# Altium schematic sheet 100046138_power.SchDoc
size 863 x 558 mm; SheetNumber: 4; SheetTotal: 4
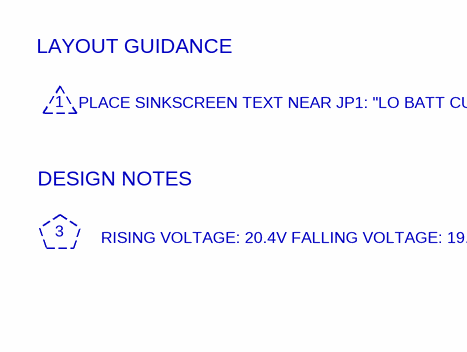
[diagram p0: 100046138_power.SchDoc, left]
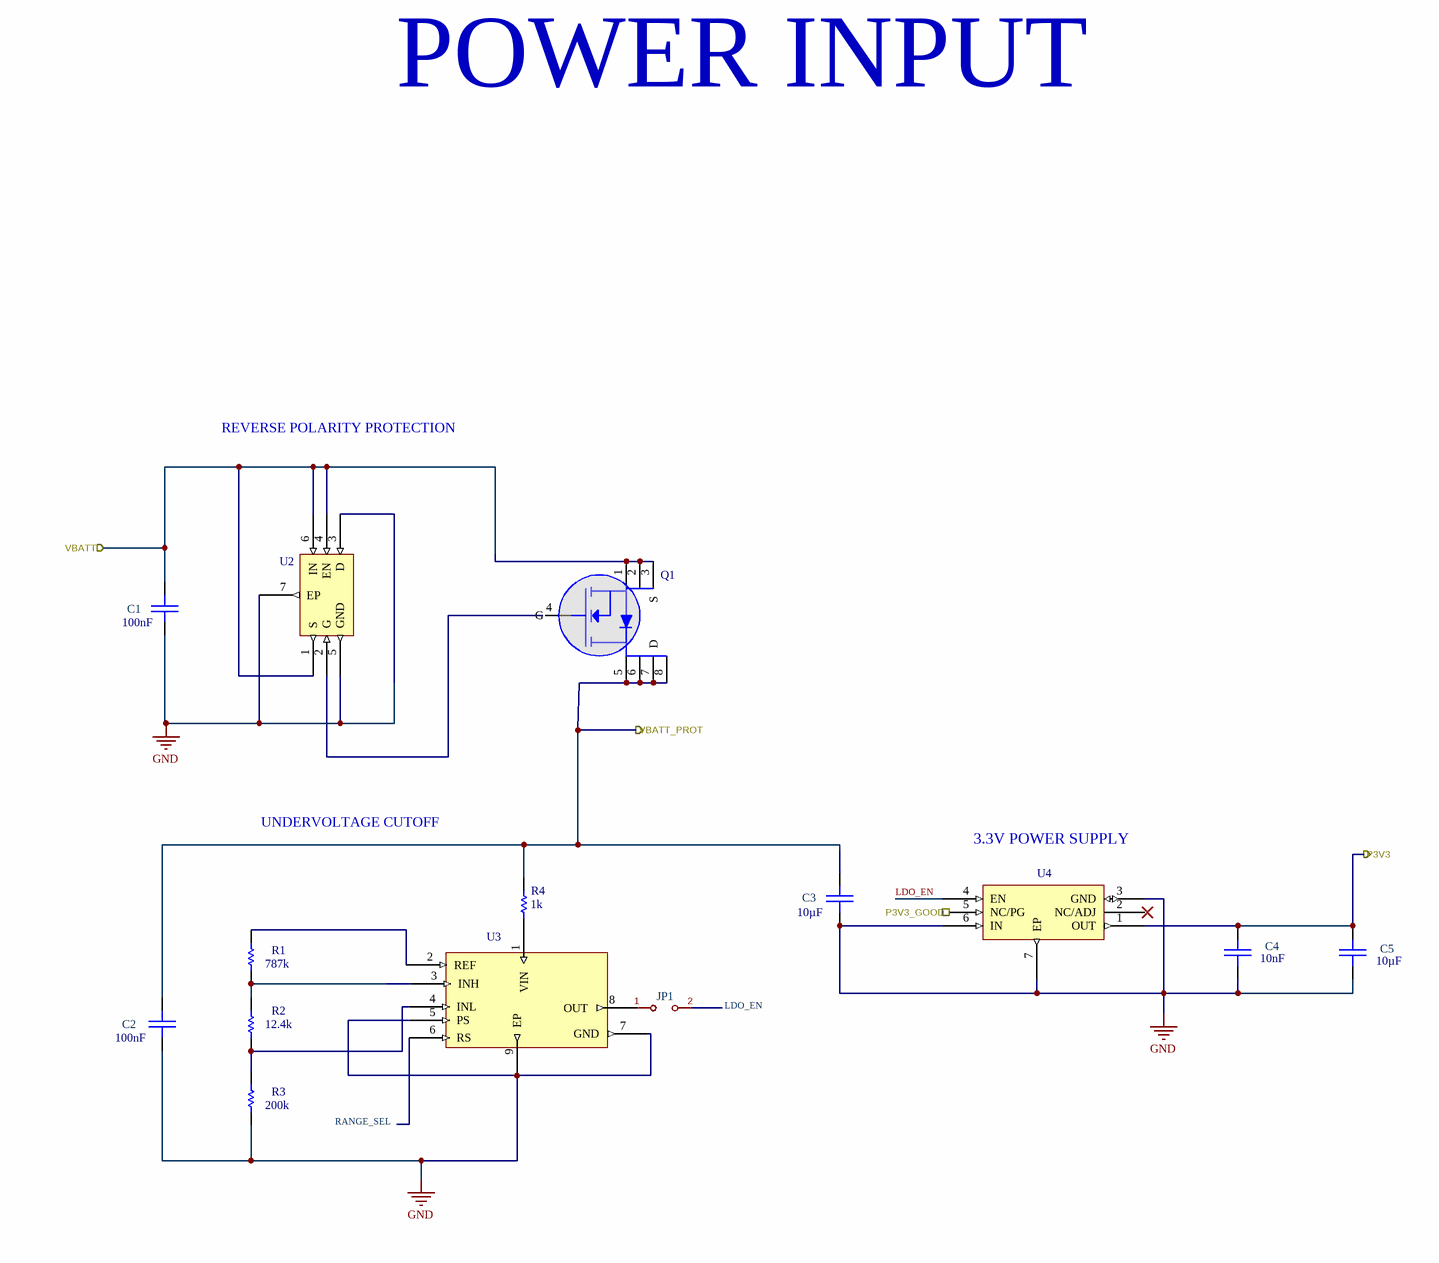
[diagram p1: 100046138_power.SchDoc, right]

## Parts
?  NCP730BMT330TBG  [IC-WDFN6-B]  (value not drawn)
C1  value 100nF  [CAP-0402-A]  (hidden comment: Cap 0402 100nF 10% X7R)
C2  value 100nF  [CAP-0402-A]  (hidden comment: Cap 0402 100nF 10% X7R)
C3  value 10µF  [CAP-0805-A]  (hidden comment: CAP 0805 10UF 50V 10% X5R)
C4  value 10nF  [CAP-0402-A]  (hidden comment: Cap 0402 10000pf 50V 10% X7R)
C5  value 10µF  [CAP-0402-A]  (hidden comment: Cap 0402 10uF 10V 20% X5R)
JP1  Jumper_2_Bridged  [SolderJumper-2_P1.3mm_Open_TrianglePad1.0x1.5mm]  (value not drawn)
Q1  MOSFET - SINGLE - N CHANNEL - 8PIN  [IC-8PQFN-A]  (value not drawn)
R1  value 787k  [RES-0402-A]  (hidden comment: RES 0402 787K 1% 1/10W)
R2  value 12.4k  [RES-0402-A]  (hidden comment: RES 0402 12.4K 1% 1/16W)
R3  value 200k  [RES-0402-C]  (hidden comment: Res 0402 200K 1/16W 1% Thick Film)
R4  value 1k  [RES-0402-A]  (hidden comment: RES 0402 1K 1/10W 1%)
U2  NCV68261MTWAITBG  [IC-WDFN6-C]  (value not drawn)
U3  LTC2965HDD  [IC-DFN8-3x3-A]  (value not drawn)

## Ports
P3V3 (out), P3V3_GOOD (out), VBATT (in), VBATT_PROT (out)

## Nets
GND: ?.3(GND) ?.6(IN) ?.7(EP) C1.1 C2.1 C3.1 C4.1 C5.1 R3.1 U2.3(D) U2.5(GND) U2.7(EP) U3.5(PS) U3.7(GND) U3.9(EP)
LDO_EN: ?.4(EN)
P3V3: ?.1(OUT) C4.2 C5.2 ; port P3V3
P3V3_GOOD: ?.5(NC/PG) ; port P3V3_GOOD
VBATT: C1.2 Q1.1(S) Q1.2(S) Q1.3(S) U2.1(S) U2.4(EN) U2.6(IN) ; port VBATT
VBATT_PROT: C2.2 C3.2 Q1.5(D) Q1.6(D) Q1.7(D) Q1.8(D) R4.2 ; port VBATT_PROT
NetJP1_1: JP1.1(A) U3.8(OUT)
NetR1_1: R1.1 R2.2 U3.3(INH)
NetR1_2: R1.2 U3.2(REF)
NetR2_1: R2.1 R3.2 U3.4(INL)

Not connected (* = marked no-connect by the designer): ? 2(NC/ADJ); JP1 2(B); Q1 4(G); R4 1; U2 2(G); U3 1(VIN) 6(RS)

## Notes on the sheet
- LAYOUT GUIDANCE
- 1
- PLACE SINKSCREEN TEXT NEAR JP1:
  "LO BATT CUTOFF"
- DESIGN NOTES
- 3
- RISING VOLTAGE: 20.4V
  FALLING VOLTAGE: 19.2V
- POWER INPUT
- REVERSE POLARITY PROTECTION
- UNDERVOLTAGE CUTOFF
- 3.3V POWER SUPPLY
- U4
- Labels drawn without touching a wire or pin: LDO_EN, RANGE_SEL
- DWG NO
- REVISIONS
- SH
- REVISION
- DESCRIPTION
- DATE(YEAR-MO-DA)
- APPROVED
- PART NO.
- DESIGN ACTIVITY
- US ARMY
  COMBAT CAPABILITIES DEVELOPMENT COMMAND ARMAMENTS CENTER
  PICATINNY ARSENAL, NEW JERSEY 07806-5000
- SIZE
- CAGE CODE
- DWG NO.
- D
- 19200
- SCALE
- NONE
- UNIT WT.
- ---
- SHEET

## Library data of the parts
? = IC-00416-3: LDO Regulator, 150 mA, 38 V, 1 uA IQ, with PG 3V3 HZ, WDFN6 2x2; Manufacturer Lifecycle Status: ACTIVE; Accuracy: 1%; Dropout Voltage: 290mV; Max Junction Temperature (Tj): 125°C; Max Supply Voltage: 38V; Min Input Voltage: 4.3V; Number of Channels: 1; Output Current: 150mA; Output Voltage: 3.3V; Voltage Tolerance: 2%; China RoHS: Compliant; Export Control Classification Number (ECCN) Code: EAR99; Harmonized Tariff Schedule (HTS) Code: 8542.39.00.60; Height - Seated (Max): 800µm; Height: 800µm; Introduction Date: 2019-11-13; Length: 2mm; Lifecycle Status: Production; Max Operating Temperature: 150°C; Min Supply Voltage: 4.3V; Number of Circuits: 1; Number of Outputs: 1; Number of Terminals: 6; REACH SVHC: Yes; RoHS: Compliant; Terminal Pitch: 650µm; Width: 2mm
C1 C2 = CAP-00363-2: Leader Qty: 100; UOM: EA; Voltage Rating: 50V; Footprint: Capacitor_SMD:C_0402_1005Metric; Case/Package: 0402; Max Operating Temperature: 125°C; Min Operating Temperature: -55°C; Mounting Technology: Surface Mount; Tolerance: 10%
C3 = CAP-00370-1: Leader Qty: 100; UOM: EA; Footprint: Capacitor_SMD:C_0805_2012Metric; Case/Package: 0805; Dielectric: X5R; Max Operating Temperature: 85°C; Min Operating Temperature: -55°C; Mounting Technology: Surface Mount
C4 = CAP-00186-4: 0402 10 nF 50 V ±10 % Tolerance X7R SMT Multilayer Ceramic Capacitor; Leader Qty: 100; Footprint: Capacitor_SMD:C_0402_1005Metric; Case/Package: 0402; Case Code (Imperial): 0402; Max Operating Temperature: 125°C; Min Operating Temperature: -55°C; Mounting Technology: Surface Mount; RoHS Compliant: Yes; Tolerance: 10%; Voltage Rating: 50V
C5 = CAP-00021-6: Capacitor Type: Ceramic; Leader Qty: 100; Footprint: Capacitor_SMD:C_0402_1005Metric; Case/Package: 0402; Max Operating Temperature: 85°C; Min Operating Temperature: -55°C; Mounting Technology: SMT; Pins: 2; RoHS Compliant: Yes; Tolerance: 20%; Voltage Rating: 10V
Q1 = CMP-00665-3: Transistor MOSFET N-Channel 40V 150A 8-Pin PQFN T/R; Manufacturer Lifecycle Status: ACTIVE; Drain to Source Resistance: 2.1mΩ; Gate to Source Voltage (Vgs): 20V; Max Junction Temperature (Tj): 150°C; Max Power Dissipation: 83W; Number of Channels: 1; Power Dissipation: 2.2W; Turn-Off Delay Time: 32ns; Turn-On Delay Time: 17ns; China RoHS: Non-Compliant; Continuous Drain Current (ID): 150A; Country of Origin: Philippines; Drain to Source Breakdown Voltage: 40V; Drain to Source Voltage (Vdss): 40V; Export Control Classification Number (ECCN) Code: EAR99; Height: 800µm; Introduction Date: 2019-11-12; Lifecycle Status: Production; Max Operating Temperature: 150°C; Min Breakdown Voltage: 40V; Min Operating Temperature: -55°C; Number of Elements: 1; Number of Terminals: 8; REACH SVHC: No; RoHS: Compliant; Schedule B: 8541290080, 8541290080
R1 = RES-00797-1: Leader Qty: 100; UOM: EA; Voltage Rating: 50V; Footprint: Resistor_SMD:R_0402_1005Metric; Case/Package: 0402; Max Operating Temperature: 155°C; Min Operating Temperature: -55°C; Mounting Technology: Surface Mount; Tolerance: 1%
R2 = RES-00798-1: Leader Qty: 100; UOM: EA; Voltage Rating: 50V; Footprint: Resistor_SMD:R_0402_1005Metric; Case/Package: 0402; Max Operating Temperature: 155°C; Min Operating Temperature: -55°C; Mounting Technology: Surface Mount; Pins: 2; Tolerance: 1%
R3 = RES-00272-5: Res Thick Film 0402 200K Ohm 1% 1/16W ±100ppm/°C Molded SMD SMD Paper Tape on Plastic Reel; Leader Qty: 100; Voltage Rating: 50V; Footprint: Resistor_SMD:R_0402_1005Metric; Case/Package: 0402; Max Operating Temperature: 125°C; Min Operating Temperature: -55°C; Mounting Technology: Surface Mount; RoHS Compliant: Yes; Tolerance: 1%
R4 = RES-00800-1: Leader Qty: 100; UOM: EA; Voltage Rating: 50V; Footprint: Resistor_SMD:R_0402_1005Metric; Case/Package: 0402; Max Operating Temperature: 155°C; Min Operating Temperature: -55°C; Mounting Technology: Surface Mount; Tolerance: 1%
U2 = IC-00420-2: OR Controller N-Channel Single 2.4Ohm Automotive 6-Pin WDFNW EP T/R; China RoHS: Compliant; Export Control Classification Number (ECCN) Code: EAR99; Harmonized Tariff Schedule (HTS) Code: 8542.39.00.60; Introduction Date: 2022-02-25; Lifecycle Status: Production; REACH SVHC: Yes; RoHS: Compliant
U3 = IC-00424-2: IC SUPERVISOR 1 CHANNEL 8DFN Supervisor Open Drain or Open Collector 1 Channel 8-DFN (3x3); Manufacturer Lifecycle Status: PRODUCTION; Max Junction Temperature (Tj): 150°C; Max Supply Voltage: 100V; Min Supply Voltage: 3.5V; Nominal Supply Current: 7µA; Number of Outputs: 1; Output Current: 5mA; Threshold Voltage: 400mV; Ambient Temperature Range High: 125°C; Case/Package: DFN; Height: 800µm; Lifecycle Status: Production; Max Operating Temperature: 125°C; Min Operating Temperature: -40°C; Mounting Technology: Surface Mount; Number of Voltages Monitored: 1; Pins: 8; REACH SVHC: No; RoHS: Compliant; Schedule B: 8542390000, 8542390000; Type: Monitor
JP1 = Jumper_2_Bridged: Value: Jumper_2_Bridged; Footprint: Jumper:SolderJumper-2_P1.3mm_Open_TrianglePad1.0x1.5mm